# Altium project capsens.PrjPCB
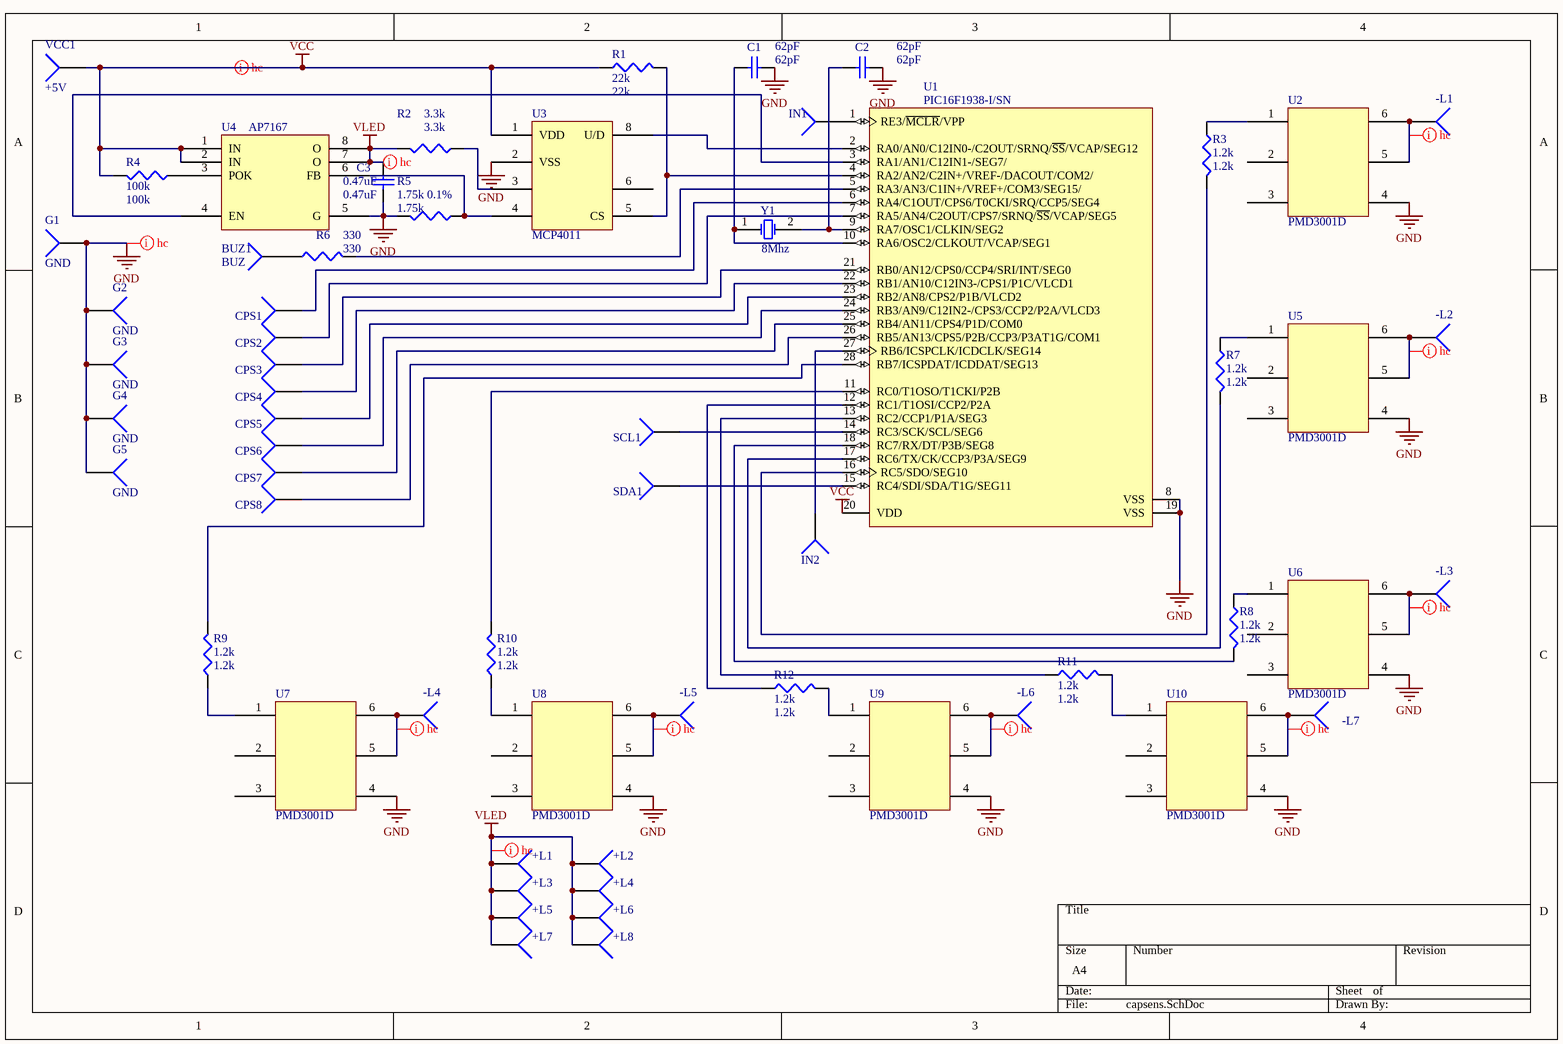
[diagram p0: capsens.SchDoc]
1 sheet, 60 parts. Net scope: global (net labels, ports and power ports of the same name join across sheets).
Board files: capsens.PcbDoc, capsens_panel.PcbDoc, led_panel.PcbDoc

## Sheet capsens.SchDoc
size A4

### Parts
+L1  +L  [PIN1]  (value not drawn)
+L2  +L  [PIN1]  (value not drawn)
+L3  +L  [PIN1]  (value not drawn)
+L4  +L  [PIN1]  (value not drawn)
+L5  +L  [PIN1]  (value not drawn)
+L6  +L  [PIN1]  (value not drawn)
+L7  +L  [PIN1]  (value not drawn)
+L8  +L  [PIN1]  (value not drawn)
-L1  -L  [PIN1]  (value not drawn)
-L2  -L  [PIN1]  (value not drawn)
-L3  -L  [PIN1]  (value not drawn)
-L4  -L  [PIN1]  (value not drawn)
-L5  -L  [PIN1]  (value not drawn)
-L6  -L  [PIN1]  (value not drawn)
-L7  -L  [PIN1]  (value not drawn)
BUZ1  BUZ  [PIN1]
C1  62pF  [1608[0603]]
C2  62pF  [1608[0603]]
C3  0.47uF  [1608[0603]]
CPS1  CPS  [PIN1L]  (value not drawn)
CPS2  CPS  [PIN1L]  (value not drawn)
CPS3  CPS  [PIN1L]  (value not drawn)
CPS4  CPS  [PIN1L]  (value not drawn)
CPS5  CPS  [PIN1L]  (value not drawn)
CPS6  CPS  [PIN1L]  (value not drawn)
CPS7  CPS  [PIN1L]  (value not drawn)
CPS8  CPS  [PIN1L]  (value not drawn)
G1  GND  [PIN1]
G2  GND  [PIN1]
G3  GND  [PIN1]
G4  GND  [PIN1]
G5  GND  [PIN1]
IN1  IN  [PIN1L]  (value not drawn)
IN2  IN  [PIN1L]  (value not drawn)
R1  22k  [J1-0603]
R2  3.3k  [J1-0603]
R3  1.2k  [J1-0603]
R4  100k  [J1-0603]
R5  1.75k 0.1%  value 1.75k  [R1206]
R6  330  [J1-0603]
R7  1.2k  [J1-0603]
R8  1.2k  [J1-0603]
R9  1.2k  [J1-0603]
R10  1.2k  [J1-0603]
R11  1.2k  [J1-0603]
R12  1.2k  [J1-0603]
SCL1  SCL  [PIN1L]  (value not drawn)
SDA1  SDA  [PIN1L]  (value not drawn)
U1  PIC16F1938-I/SN  [SOIC-SO28_N]
U2  PMD3001D  [SOT457]
U3  MCP4011  [SOIC150-8_N]
U4  AP7167  [SOIC150-8_N]
U5  PMD3001D  [SOT457]
U6  PMD3001D  [SOT457]
U7  PMD3001D  [SOT457]
U8  PMD3001D  [SOT457]
U9  PMD3001D  [SOT457]
U10  PMD3001D  [SOT457]
VCC1  +5V  [PIN1]
Y1  8Mhz  [XTAL]

### Nets
GND: C1.1 C2.1 C3.1 G1.1 G2.1 G3.1 G4.1 G5.1 R5.2 U1.8(VSS) U1.19(VSS) U2.4 U3.2(VSS) U4.5(G) U5.4 U6.4 U7.4 U8.4 U9.4 U10.4
VCC: R1.1 R4.2 U1.20(VDD) U3.1(VDD) U4.1(IN) U4.2(IN) VCC1.1
VLED: +L1.1 +L2.1 +L3.1 +L4.1 +L5.1 +L6.1 +L7.1 +L8.1 C3.2 R2.2 U4.7(O) U4.8(O)
Net-L1_1: -L1.1 U2.5 U2.6
Net-L2_1: -L2.1 U5.5 U5.6
Net-L3_1: -L3.1 U6.5 U6.6
Net-L4_1: -L4.1 U7.5 U7.6
Net-L5_1: -L5.1 U8.5 U8.6
Net-L6_1: -L6.1 U9.5 U9.6
Net-L7_1: -L7.1 U10.5 U10.6
NetBUZ1_1: BUZ1.1 R6.1
NetC1_2: C1.2 U1.10(RA6/OSC2/CLKOUT/VCAP/SEG1) Y1.1(OSC1)
NetC2_2: C2.2 U1.9(RA7/OSC1/CLKIN/SEG2) Y1.2(OSC2)
NetCPS1_1: CPS1.1 U1.6(RA4/C1OUT/CPS6/T0CKI/SRQ/CCP5/SEG4)
NetCPS2_1: CPS2.1 U1.7(RA5/AN4/C2OUT/CPS7/SRNQ/~{SS}/VCAP/SEG5)
NetCPS3_1: CPS3.1 U1.21(RB0/AN12/CPS0/CCP4/SRI/INT/SEG0)
NetCPS4_1: CPS4.1 U1.22(RB1/AN10/C12IN3-/CPS1/P1C/VLCD1)
NetCPS5_1: CPS5.1 U1.23(RB2/AN8/CPS2/P1B/VLCD2)
NetCPS6_1: CPS6.1 U1.24(RB3/AN9/C12IN2-/CPS3/CCP2/P2A/VLCD3)
NetCPS7_1: CPS7.1 U1.25(RB4/AN11/CPS4/P1D/COM0)
NetCPS8_1: CPS8.1 U1.26(RB5/AN13/CPS5/P2B/CCP3/P3AT1G/COM1)
NetIN1_1: IN1.1 U1.1(RE3/~{MCLR}/VPP)
NetIN2_1: IN2.1 U1.27(RB6/ICSPCLK/ICDCLK/SEG14)
NetR1_2: R1.2 U1.4(RA2/AN2/C2IN+/VREF-/DACOUT/COM2/) U3.5(CS)
NetR2_1: R2.1 U3.3(A)
NetR3_1: R3.1 U2.1
NetR3_2: R3.2 U1.16(RC5/SDO/SEG10)
NetR4_1: R4.1 U4.3(POK)
NetR5_1: R5.1 U3.4(W) U4.6(FB)
NetR6_2: R6.2 U1.5(RA3/AN3/C1IN+/VREF+/COM3/SEG15/)
NetR7_1: R7.1 U5.1
NetR7_2: R7.2 U1.17(RC6/TX/CK/CCP3/P3A/SEG9)
NetR8_1: R8.1 U6.1
NetR8_2: R8.2 U1.18(RC7/RX/DT/P3B/SEG8)
NetR9_1: R9.1 U7.1
NetR9_2: R9.2 U1.28(RB7/ICSPDAT/ICDDAT/SEG13)
NetR10_1: R10.1 U8.1
NetR10_2: R10.2 U1.11(RC0/T1OSO/T1CKI/P2B)
NetR11_1: R11.1 U1.13(RC2/CCP1/P1A/SEG3)
NetR11_2: R11.2 U10.1
NetR12_1: R12.1 U1.12(RC1/T1OSI/CCP2/P2A)
NetR12_2: R12.2 U9.1
NetSCL1_1: SCL1.1 U1.14(RC3/SCK/SCL/SEG6)
NetSDA1_1: SDA1.1 U1.15(RC4/SDI/SDA/T1G/SEG11)
NetU1_2: U1.2(RA0/AN0/C12IN0-/C2OUT/SRNQ/~{SS}/VCAP/SEG12) U3.8(U/D)
NetU1_3: U1.3(RA1/AN1/C12IN1-/SEG7/) U4.4(EN)

Not connected (* = marked no-connect by the designer): U2 2 3; U3 6(B); U5 2 3; U6 2 3; U7 2 3; U8 2 3; U9 2 3; U10 2 3

### Layout directives
net class hc: GND, Net-L1_1, Net-L2_1, Net-L3_1, Net-L4_1, Net-L5_1, Net-L6_1, Net-L7_1, VCC, VLED

### Library data of the parts
+L1-+L8 -L1--L7 BUZ1 CPS1-CPS8 G1-G5 IN1 IN2 SCL1 SDA1 VCC1 = Socket: LatestRevisionDate: 17-Jul-2002; LatestRevisionNote: Re-released for DXP Platform.; Publisher: Altium Limited
C1-C3 = Cap: Capacitor; Published: 8-Jun-2000; LatestRevisionDate: 17-Jul-2002; LatestRevisionNote: Re-released for DXP Platform.; PackageReference: RAD-0.3; Publisher: Altium Limited; PackageDescription: Radial Cap, Thru-Hole; 2 Leads; 0.3 in Pin Spacing
  C1 C2: Value: 62pF
  C3: Value: 0.47uF
R1-R12 = Res3: Resistor; Published: 8-Jun-2000; LatestRevisionDate: 29-May-2009; LatestRevisionNote: IPC-7351 Footprint Added.; PackageReference: J1-0603; Publisher: Altium Limited; PackageDescription: Chip Resistor
  R1: Value: 22k
  R2: Value: 3.3k
  R3 R7-R12: Value: 1.2k
  R4: Value: 100k
  R6: Value: 330
U1 = PIC16F1936-I/SO: CMOS Microcontroller with LCD Driver, 8K (words) Program Memory, 256 Bytes Data Memory, 512 Bytes SRAM, 25 I/O's, 28-Pin SOIC, Industrial Temperature; Published: 40149; LatestRevisionDate: 11-Aug-2010; LatestRevisionNote: Sch. layout revised.; DatasheetVersion: revC, Sep-2009; PackageVersion: revBB, Aug-2009; PackageReference: SOIC-SO28; Publisher: Altium Limited; PackageDescription: 28-Lead Plastic Small Outline (SO) - Wide 7.50mm Body [SOIC]; Supplier 1: Digi-Key; Supplier Part Number 1: PIC16F1936-I/SO-ND; Supplier 2: Farnell; Supplier Part Number 2: 1755820; Code_JEDEC: MS-013; ComponentLink1Description: Datasheet; ComponentLink1URL: http://ww1.microchip.com/downloads/en/DeviceDoc/41364C.pdf; ComponentLink2Description: Packaging Specification; ComponentLink2URL: http://www.microchip.com/stellent/groups/techpub_sg/documents/packagingspec/en012702.pdf; ComponentLink3Description: Microchip.com Home; ComponentLink3URL: http://www.microchip.com/
Y1 = XTAL: Crystal Oscillator; Published: 8-Jun-2000; LatestRevisionDate: 17-Jul-2002; LatestRevisionNote: Re-released for DXP Platform.; PackageReference: R38; Publisher: Altium Limited; PackageDescription: Crystal, Thru-Hole; 2 Leads; Body 3.1 x 8.2 mm (Dia.xH)